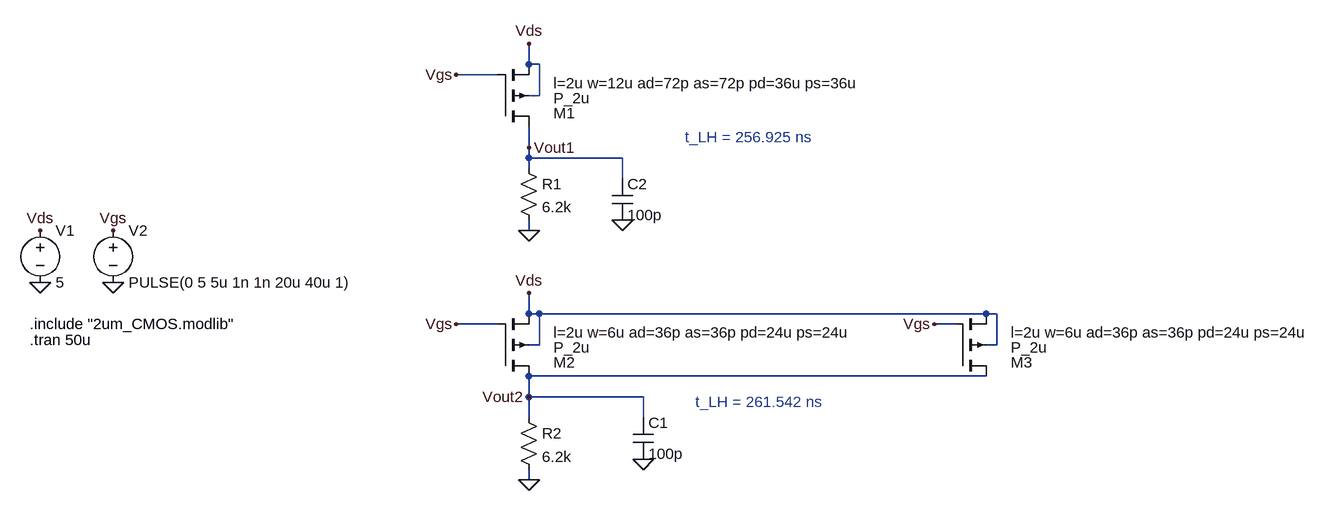
[diagram p0: schematic 2c.asc]
2c.asc, the LTspice schematic file:
Version 4
SHEET 1 1560 680
WIRE 224 -176 224 -208
WIRE 240 -176 224 -176
WIRE 176 -160 112 -160
WIRE 240 -128 240 -176
WIRE 240 -128 224 -128
WIRE 224 -48 224 -80
WIRE 224 -32 224 -48
WIRE 368 -32 224 -32
WIRE 224 -16 224 -32
WIRE 368 0 368 -32
WIRE 224 80 224 64
WIRE 224 208 224 176
WIRE 240 208 224 208
WIRE 928 208 240 208
WIRE 944 208 928 208
WIRE 176 224 112 224
WIRE 880 224 848 224
WIRE 240 256 240 208
WIRE 240 256 224 256
WIRE 944 256 944 208
WIRE 944 256 928 256
WIRE 928 304 224 304
WIRE 224 336 224 304
WIRE 400 336 224 336
WIRE 224 368 224 336
WIRE 400 368 400 336
WIRE 224 464 224 448
FLAG -416 160 0
FLAG -528 160 0
FLAG -528 80 Vds
FLAG -416 80 Vgs
FLAG 112 -160 Vgs
FLAG 224 -208 Vds
FLAG 224 80 0
FLAG 224 -48 Vout1
FLAG 112 224 Vgs
FLAG 224 176 Vds
FLAG 224 464 0
FLAG 224 336 Vout2
FLAG 848 224 Vgs
FLAG 400 432 0
FLAG 368 64 0
SYMBOL pmos4 176 -80 M180
WINDOW 0 86 21 Left 2
WINDOW 3 86 44 Left 2
WINDOW 123 86 67 Left 2
SYMATTR InstName M1
SYMATTR Value P_2u
SYMATTR Value2 l=2u w=12u ad=72p as=72p pd=36u ps=36u
SYMBOL voltage -528 64 R0
WINDOW 123 0 0 Left 0
WINDOW 39 0 0 Left 0
SYMATTR InstName V1
SYMATTR Value 5
SYMBOL voltage -416 64 R0
WINDOW 123 0 0 Left 0
WINDOW 39 0 0 Left 0
SYMATTR InstName V2
SYMATTR Value PULSE(0 5 5u 1n 1n 20u 40u 1)
SYMBOL res 208 -32 R0
SYMATTR InstName R1
SYMATTR Value 6.2k
SYMBOL pmos4 176 304 M180
WINDOW 0 86 21 Left 2
WINDOW 3 86 44 Left 2
WINDOW 123 86 67 Left 2
SYMATTR InstName M2
SYMATTR Value P_2u
SYMATTR Value2 l=2u w=6u ad=36p as=36p pd=24u ps=24u
SYMBOL res 208 352 R0
SYMATTR InstName R2
SYMATTR Value 6.2k
SYMBOL pmos4 880 304 M180
WINDOW 0 86 21 Left 2
WINDOW 3 86 44 Left 2
WINDOW 123 86 67 Left 2
SYMATTR InstName M3
SYMATTR Value P_2u
SYMATTR Value2 l=2u w=6u ad=36p as=36p pd=24u ps=24u
SYMBOL cap 384 368 R0
SYMATTR InstName C1
SYMATTR Value 100p
SYMBOL cap 352 0 R0
SYMATTR InstName C2
SYMATTR Value 100p
TEXT -544 224 Left 2 !.include "2um_CMOS.modlib"
TEXT -544 248 Left 2 !.tran 50u
TEXT 464 -64 Left 2 ;t_LH = 256.925 ns
TEXT 480 344 Left 2 ;t_LH = 261.542 ns

The netlist it stands for:
* 2c.asc
M1 Vout1 Vgs Vds Vds P_2u l=2u w=12u ad=72p as=72p pd=36u ps=36u
V1 Vds 0 5
V2 Vgs 0 PULSE(0 5 5u 1n 1n 20u 40u 1)
R1 Vout1 0 6.2k
M2 Vout2 Vgs Vds Vds P_2u l=2u w=6u ad=36p as=36p pd=24u ps=24u
R2 Vout2 0 6.2k
M3 Vout2 Vgs Vds Vds P_2u l=2u w=6u ad=36p as=36p pd=24u ps=24u
C1 Vout2 0 100p
C2 Vout1 0 100p
.model NMOS NMOS
.model PMOS PMOS
.lib standard.mos
.include "2um_CMOS.modlib"
.tran 50u
* t_LH = 256.925 ns
* t_LH = 261.542 ns
.backanno
.end